# Altium schematic sheet Dual_Channel.SchDoc
size OrCAD E; SheetNumber: 4; SheetTotal: 6
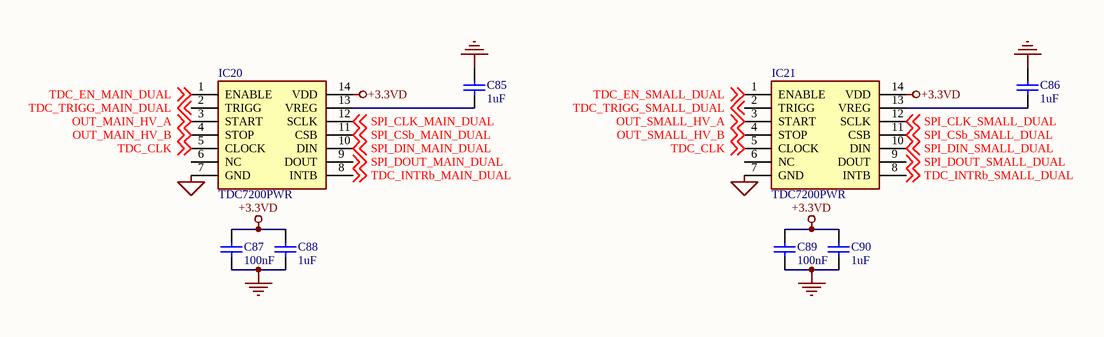
[diagram p0: Dual_Channel.SchDoc]

## Parts
C85  1uF  [CAPC1608X90X35ML10T15]
C86  1uF  [CAPC1608X90X35ML10T15]
C87  100nF  [CAPC1608X90X35ML10T15]
C88  1uF  [CAPC1608X90X35ML10T15]
C89  100nF  [CAPC1608X90X35ML10T15]
C90  1uF  [CAPC1608X90X35ML10T15]
IC20  TDC7200PWR  [SOP65P640X120-14N]
IC21  TDC7200PWR  [SOP65P640X120-14N]

## Nets
+3.3VD: C87.1 C88.1 C89.1 C90.1 IC20.14(VDD) IC21.14(VDD)
GND: C85.2 C86.2 C87.2 C88.2 C89.2 C90.2 IC20.7(GND) IC21.7(GND)
OUT_MAIN_HV_A: IC20.3(START) ; off-sheet OUT_MAIN_HV_A
OUT_MAIN_HV_B: IC20.4(STOP) ; off-sheet OUT_MAIN_HV_B
OUT_SMALL_HV_A: IC21.3(START) ; off-sheet OUT_SMALL_HV_A
OUT_SMALL_HV_B: IC21.4(STOP) ; off-sheet OUT_SMALL_HV_B
SPI_CLK_MAIN_DUAL: IC20.12(SCLK) ; off-sheet SPI_CLK_MAIN_DUAL
SPI_CLK_SMALL_DUAL: IC21.12(SCLK) ; off-sheet SPI_CLK_SMALL_DUAL
SPI_CSb_MAIN_DUAL: IC20.11(CSB) ; off-sheet SPI_CSb_MAIN_DUAL
SPI_CSb_SMALL_DUAL: IC21.11(CSB) ; off-sheet SPI_CSb_SMALL_DUAL
SPI_DIN_MAIN_DUAL: IC20.10(DIN) ; off-sheet SPI_DIN_MAIN_DUAL
SPI_DIN_SMALL_DUAL: IC21.10(DIN) ; off-sheet SPI_DIN_SMALL_DUAL
SPI_DOUT_MAIN_DUAL: IC20.9(DOUT) ; off-sheet SPI_DOUT_MAIN_DUAL
SPI_DOUT_SMALL_DUAL: IC21.9(DOUT) ; off-sheet SPI_DOUT_SMALL_DUAL
TDC_CLK: IC20.5(CLOCK) IC21.5(CLOCK) ; off-sheet TDC_CLK
TDC_EN_MAIN_DUAL: IC20.1(ENABLE) ; off-sheet TDC_EN_MAIN_DUAL
TDC_EN_SMALL_DUAL: IC21.1(ENABLE) ; off-sheet TDC_EN_SMALL_DUAL
TDC_INTRb_MAIN_DUAL: IC20.8(INTB) ; off-sheet TDC_INTRb_MAIN_DUAL
TDC_INTRb_SMALL_DUAL: IC21.8(INTB) ; off-sheet TDC_INTRb_SMALL_DUAL
TDC_TRIGG_MAIN_DUAL: IC20.2(TRIGG) ; off-sheet TDC_TRIGG_MAIN_DUAL
TDC_TRIGG_SMALL_DUAL: IC21.2(TRIGG) ; off-sheet TDC_TRIGG_SMALL_DUAL
NetC85_1: C85.1 IC20.13(VREG)
NetC86_1: C86.1 IC21.13(VREG)

Not connected (* = marked no-connect by the designer): IC20 6(NC); IC21 6(NC)

## Library data of the parts
C85-C90 = CMP-2000-04945-1: 0603; Manufacturer: Murata; Capacitance: 22pF; Tolerance (%): ±5%; Rated Voltage: 50V; Dielectric: C0G; Manufacturer URL: http://www.murata.com/; Datasheet Version: Jul-06; Package Reference: 603; Case Size/Dimension: 0603; Package Description: 2-Pin Surface Mount Device, Body 1.6 x 0.8 mm; Datasheet URL: https://datasheet.ciiva.com/11786/0900766b807a1cab-11786398.pdf
IC20 IC21 = TDC7200PWR: Integrated Circuit; Manufacturer_Name: Texas Instruments; Datasheet Link: http://www.ti.com/lit/gpn/tdc7200; Height: 1.2mm; Manufacturer_Part_Number: TDC7200PWR